# Altium schematic sheet [7]Battery Managment.SchDoc
size B
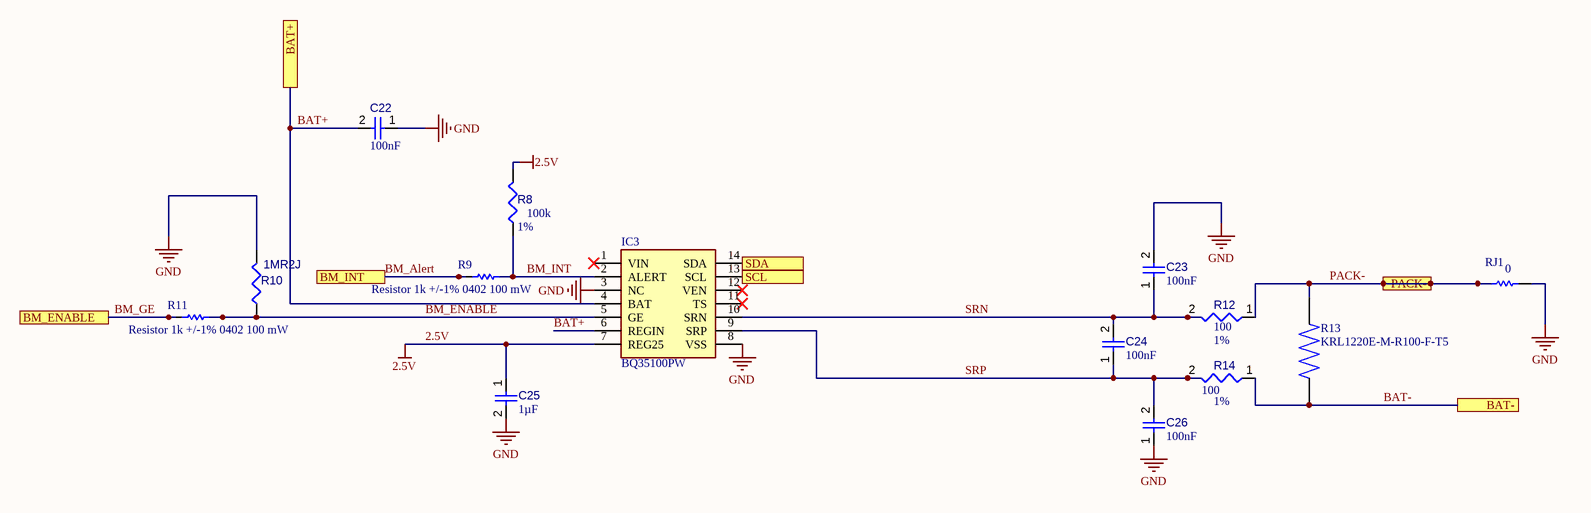
[diagram p0: [7]Battery Managment.SchDoc]

## Parts
C22  value 100nF  [CAPC0402(1005)60_L]  (hidden comment: Capacitor 100nF +/-20% 25V 0402)
C23  value 100nF  [CAPC0402(1005)60_L]  (hidden comment: Capacitor 100nF +/-20% 25V 0402)
C24  value 100nF  [CAPC0402(1005)60_L]  (hidden comment: Capacitor 100nF +/-20% 25V 0402)
C25  value 1µF  [CAPC0402(1005)60_L]  (hidden comment: Capacitor 1µF +/-20% 10V 0402)
C26  value 100nF  [CAPC0402(1005)60_L]  (hidden comment: Capacitor 100nF +/-20% 25V 0402)
IC3  BQ35100PW  [SOP65P640X120-14N]
R8  value 100k  Tolerance: 1%  [RESC1005X40X25ML05T05]  (hidden comment: Resistor 100k +/-1% 0402 63 mW)
R9  Resistor 1k +/-1% 0402 100 mW  [RESC1005X40X25ML05T05]
R10  1MR2J  [RESC0402(1005)_L]
R11  Resistor 1k +/-1% 0402 100 mW  [RESC1005X40X25ML05T05]
R12  value 100  Tolerance: 1%  [RESC0402(1005)_L]  (hidden comment: 100R2F)
R13  KRL1220E-M-R100-F-T5  [RESC2012X70N]
R14  value 100  Tolerance: 1%  [RESC0402(1005)_L]  (hidden comment: 100R2F)
RJ1  value 0  [RESC1608X55X25ML10T15]  (hidden comment: Resistor 0R +/- 5% 0603 100 mW)

## Ports
BAT+, BAT-, BM_ENABLE, BM_INT, PACK-, SCL, SDA

## Nets
2.5V: C25.1 IC3.7(REG25) R8.2
GND: C22.1 C23.2 C25.2 C26.1 IC3.3(NC) IC3.8(VSS) R10.2 RJ1.2
BAT+: C22.2 IC3.4(BAT) IC3.6(REGIN) ; port BAT+
BAT-: R13.1 R14.1 ; port BAT-
BM_Alert: R9.2 ; port BM_INT
BM_ENABLE: IC3.5(GE) R10.1 R11.1
BM_GE: R11.2 ; port BM_ENABLE
BM_INT: IC3.2(ALERT) R8.1 R9.1
PACK-: R12.1 R13.2 RJ1.1 ; port PACK-
SCL: IC3.13(SCL) ; port SCL
SDA: IC3.14(SDA) ; port SDA
SRN: C23.1 C24.2 IC3.10(SRN) R12.2
SRP: C24.1 C26.2 IC3.9(SRP) R14.2

Not connected (* = marked no-connect by the designer): IC3 1(VIN)* 11(TS)* 12(VEN)*

## Library data of the parts
C22-C24 C26 = CMP-001-00065-4: Chip Capacitor, 100nF +/-20%, 25V, 0402, Thickness 0.6 mm; Tolerance: 10%; Max Operating Temperature: 85°C; Voltage Rating: 25V; Pins: 2; Mounting Technology: SMT; Min Operating Temperature: -55°C; Case/Package: 0402
C25 = CMP-001-00063-3: Chip Capacitor, 1µF +/-20%, 10V, 0402, Thickness 0.6 mm; Tolerance: 10%; Voltage Rating: 10V; Min Operating Temperature: -55°C; Max Operating Temperature: 85°C; Case/Package: 0402; Mounting Technology: SMT; Pins: 2
IC3 = BQ35100PW: Integrated Circuit; Manufacturer_Name: Texas Instruments; Datasheet Link: http://www.ti.com/lit/gpn/bq35100; Height: 1.2mm; Manufacturer_Part_Number: BQ35100PW; Arrow Part Number: BQ35100PW; Arrow Price/Stock: https://www.arrow.com/en/products/bq35100pw/texas-instruments; Mouser Part Number: 595-BQ35100PW; Mouser Price/Stock: https://www.mouser.co.uk/ProductDetail/Texas-Instruments/BQ35100PW?qs=Jwe3UnxISIaIuldqtot6tg%3D%3D
R8 = CMP-009-00021-5: Chip Resistor, 100 KOhm, +/- 1%, 0.063 W, -55 to 155 degC, 0402 (1005 Metric); Power: 63mW; Voltage Rating: 50V; Pins: 2; Max Operating Temperature: 155°C; Case/Package: 0402; Min Operating Temperature: -55°C; Mounting Technology: SM; RoHS Compliant: True
R9 R11 = CMP-009-00009-5: Chip Resistor, 1 KOhm, +/- 1%, 0.1 W, -55 to 155 degC, 0402 (1005 Metric); Power: 100mW; Voltage Rating: 50V; Value: 1k; Tolerance: 1%; Min Operating Temperature: -55°C; Max Operating Temperature: 155°C; RoHS Compliant: True; Mounting Technology: SM; Pins: 2; Case/Package: 0402
R10 = CMP-009-00077-2: 1M 0.063W 5% 0402 (1005 Metric)  SMD; Power: 63mW; Value: 1M; Tolerance: 5%; Case/Package: 0402; Pins: 2; Mounting Technology: SMT
R12 R14 = CMP-009-00065-2: 100R 0.063W 1% 0402 (1005 Metric)  SMD; Power: 63mW; Case/Package: 0402; Pins: 2; Mounting Technology: SMT
R13 = KRL1220E-M-R100-F-T5: 0.1 Ohm current sense resistor; Package: None; Price: None; Value: *; MP: KRL1220E-M-R100-F-T5; Availability: Unavailable
RJ1 = CMP-009-00006-5: Chip Resistor, 0 Ohm, 0.1 W, -55 to 155 degC, 0603 (1608 Metric); Power: 100mW; Voltage Rating: 50V; RoHS Compliant: True; Max Operating Temperature: 155°C; Min Operating Temperature: -55°C; Tolerance: 5%; Pins: 2; Case/Package: 0603; Mounting Technology: SM